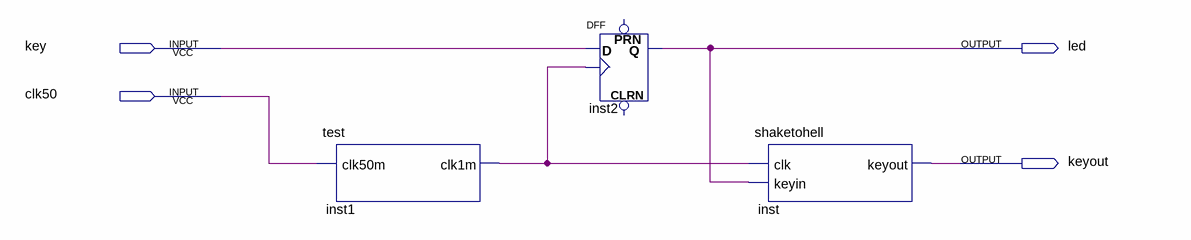
[diagram p0: schematic sheet]
// Quartus schematic shaketohell.bdf as structural Verilog: 3 symbols, 4 pins
module shaketohell (
  input  key,
  input  clk50,
  output led,
  output keyout
);

  wire inst1_clk1m;

  test inst1 (.clk50m(clk50), .clk1m(inst1_clk1m));
  DFF inst2 (.CLK(inst1_clk1m), .D(key), .Q(led));  // open: CLRN, PRN
  shaketohell inst (.clk(inst1_clk1m), .keyin(led), .keyout(keyout));
endmodule
